# EAGLE design Drinks_MotorDriver-v0.2 (EAGLE 6.4)
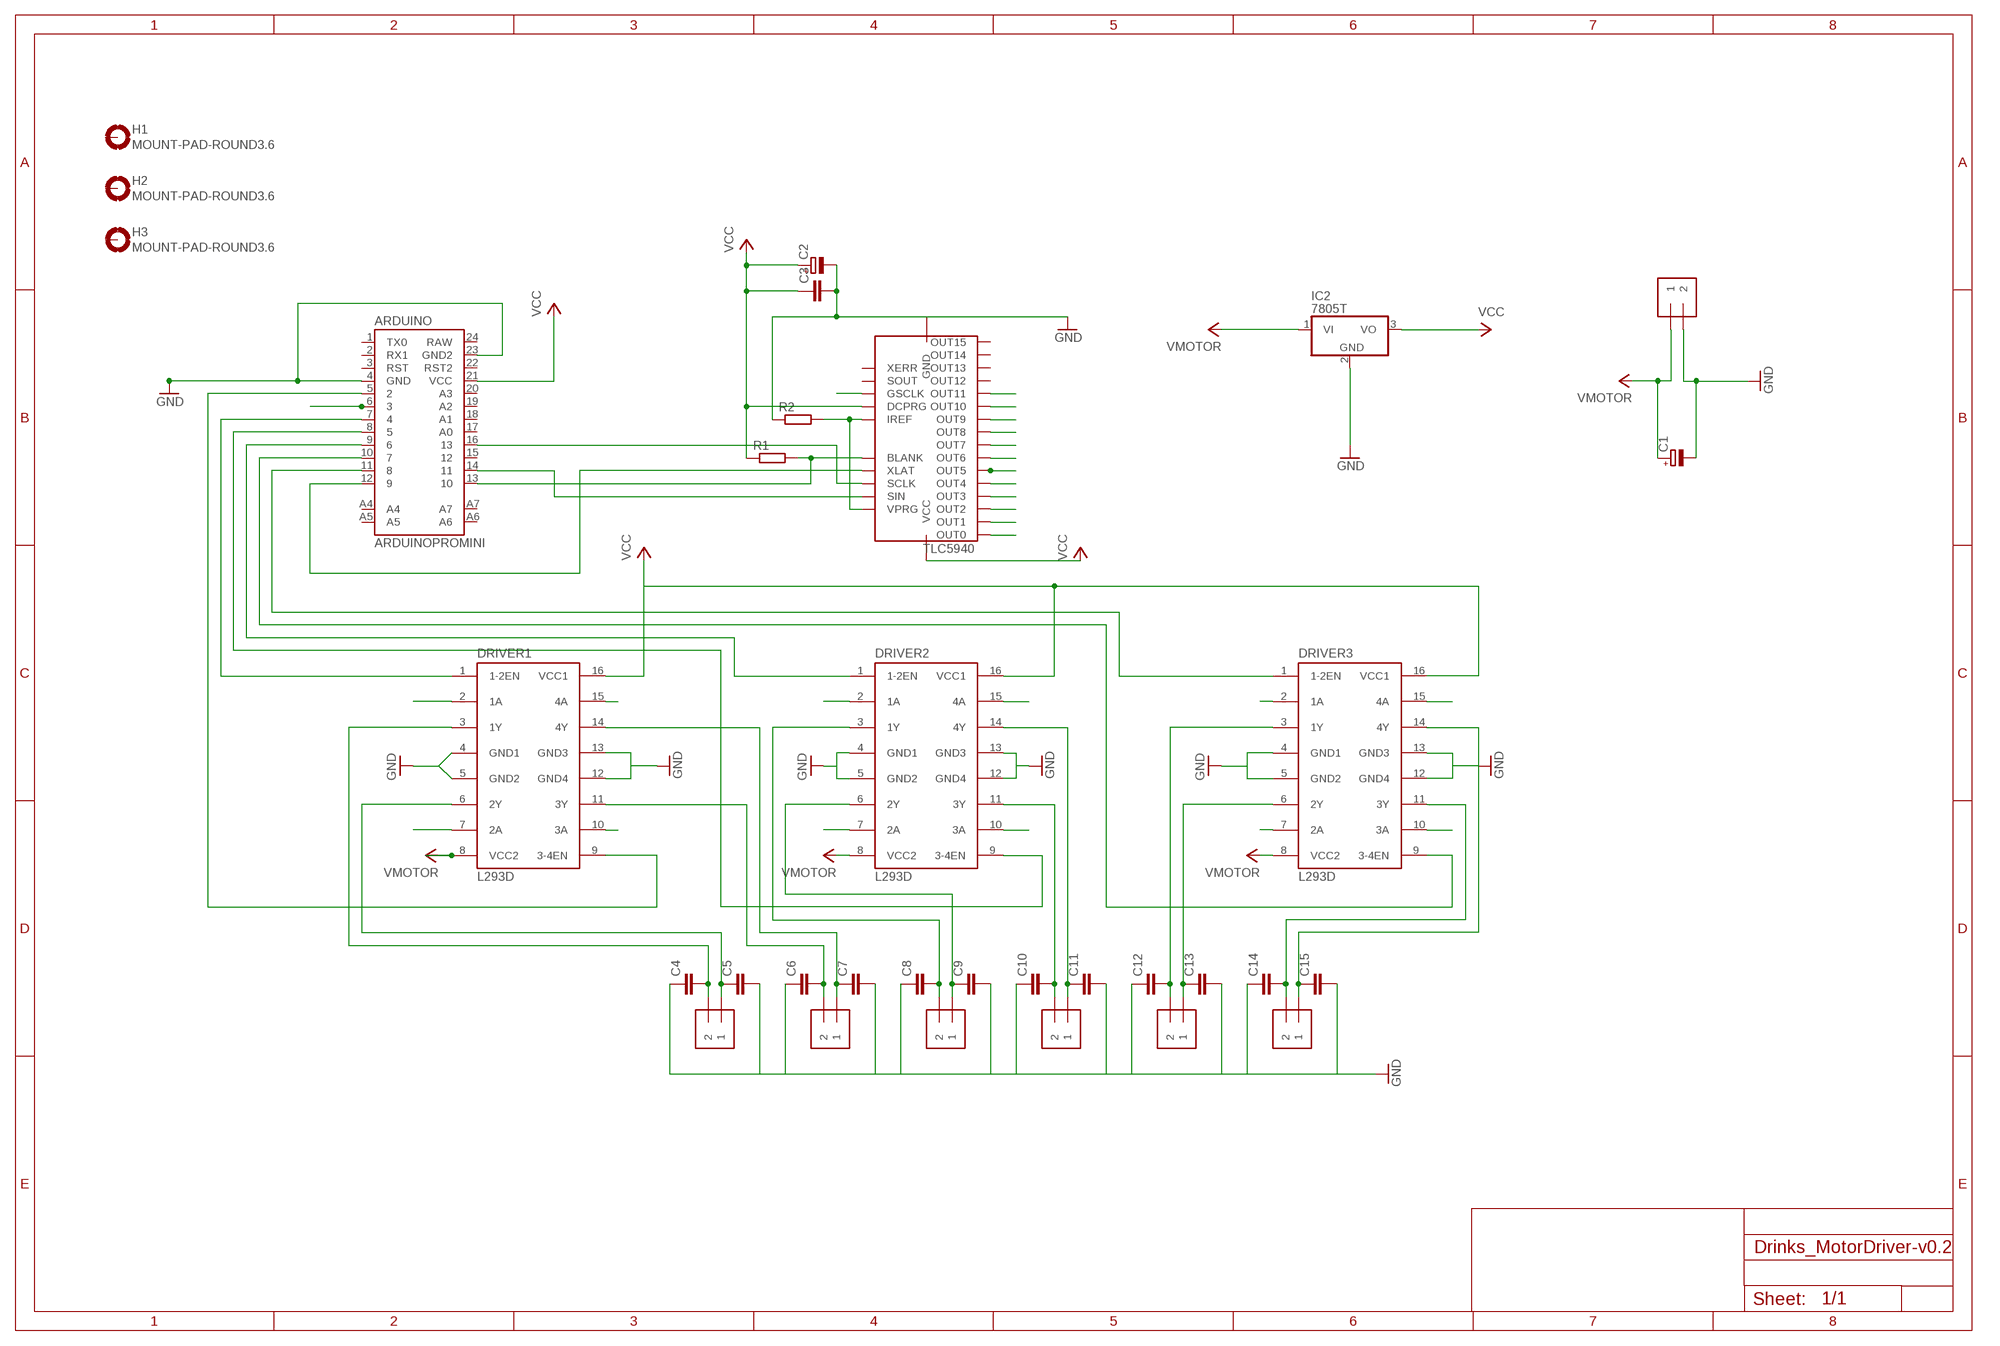
[diagram p0: schematic, sheet 1]

## Parts
ARDUINO  ARDUINOPROMINI  ARDUINO_PRO_MINI  [ARDUINO_PRO_MINI]
C1  CPOL-EUE5-8.5  [E5-8,5]
C2  CPOL-EUE5-8.5  [E5-8,5]
C3  C-EU025-025X050  [C025-025X050]
C4  C-EU025-025X050  [C025-025X050]
C5  C-EU025-025X050  [C025-025X050]
C6  C-EU025-025X050  [C025-025X050]
C7  C-EU025-025X050  [C025-025X050]
C8  C-EU025-025X050  [C025-025X050]
C9  C-EU025-025X050  [C025-025X050]
C10  C-EU025-025X050  [C025-025X050]
C11  C-EU025-025X050  [C025-025X050]
C12  C-EU025-025X050  [C025-025X050]
C13  C-EU025-025X050  [C025-025X050]
C14  C-EU025-025X050  [C025-025X050]
C15  C-EU025-025X050  [C025-025X050]
DRIVER1  L293D  [DIL16]
DRIVER2  L293D  [DIL16]
DRIVER3  L293D  [DIL16]
H1  MOUNT-PAD-ROUND3.6  [3,6-PAD]
H2  MOUNT-PAD-ROUND3.6  [3,6-PAD]
H3  MOUNT-PAD-ROUND3.6  [3,6-PAD]
IC2  7805T  [TO220H]
MOT1  1X2-3.5MM  [1X2-3.5MM]
MOT2  1X2-3.5MM  [1X2-3.5MM]
MOT3  1X2-3.5MM  [1X2-3.5MM]
MOT4  1X2-3.5MM  [1X2-3.5MM]
MOT5  1X2-3.5MM  [1X2-3.5MM]
MOT6  1X2-3.5MM  [1X2-3.5MM]
R1  R-EU_0204/7  [0204/7]
R2  R-EU_0204/7  [0204/7]
TLC5940  IC-PACKAGE_DIL28-4  [IC-PACKAGE_DIL28-4]
VIN  1X2-3.5MM  [1X2-3.5MM]

## Nets
GND: ARDUINO.4(GND) ARDUINO.23(GND2) C1.- C2.- C3.2 C4.1 C5.2 C6.1 C7.2 C8.1 C9.2 C10.1 C11.2 C12.1 C13.2 C14.1 C15.2 DRIVER1.4(GND1) DRIVER1.5(GND2) DRIVER1.12(GND4) DRIVER1.13(GND3) DRIVER2.4(GND1) DRIVER2.5(GND2) DRIVER2.12(GND4) DRIVER2.13(GND3) DRIVER3.4(GND1) DRIVER3.5(GND2) DRIVER3.12(GND4) DRIVER3.13(GND3) IC2.2(GND) R2.1 TLC5940.22(GND) VIN.2
GSCLK: ARDUINO.6 TLC5940.18(GSCLK)
MOT1A: DRIVER1.2(1A) TLC5940.28(OUT0)
MOT1B: DRIVER1.7(2A) TLC5940.1(OUT1)
MOT2A: DRIVER1.10(3A) TLC5940.2(OUT2)
MOT2B: DRIVER1.15(4A) TLC5940.3(OUT3)
MOT3A: DRIVER2.2(1A) TLC5940.4(OUT4)
MOT3B: DRIVER2.7(2A) TLC5940.5(OUT5)
MOT4A: DRIVER2.10(3A) TLC5940.6(OUT6)
MOT4B: DRIVER2.15(4A) TLC5940.7(OUT7)
MOT5A: DRIVER3.2(1A) TLC5940.8(OUT8)
MOT5B: DRIVER3.7(2A) TLC5940.9(OUT9)
MOT6A: DRIVER3.10(3A) TLC5940.10(OUT10)
MOT6B: DRIVER3.15(4A) TLC5940.11(OUT11)
N$1: ARDUINO.13 R1.2 TLC5940.23(BLANK)
N$2: R2.2 TLC5940.20(IREF) TLC5940.27(VPRG)
N$4: ARDUINO.14 TLC5940.26(SIN)
N$6: ARDUINO.12 TLC5940.24(XLAT)
N$12: ARDUINO.5 DRIVER1.9(3-4EN)
N$13: ARDUINO.7 DRIVER1.1(1-2EN)
N$14: ARDUINO.8 DRIVER2.9(3-4EN)
N$16: ARDUINO.9 DRIVER2.1(1-2EN)
N$17: ARDUINO.10 DRIVER3.9(3-4EN)
N$18: ARDUINO.11 DRIVER3.1(1-2EN)
N$19: C4.2 DRIVER1.3(1Y) MOT1.2
N$20: C5.1 DRIVER1.6(2Y) MOT1.1
N$21: C7.1 DRIVER1.14(4Y) MOT2.1
N$22: C6.2 DRIVER1.11(3Y) MOT2.2
N$23: C8.2 DRIVER2.3(1Y) MOT3.2
N$24: C9.1 DRIVER2.6(2Y) MOT3.1
N$25: C10.2 DRIVER2.11(3Y) MOT4.2
N$26: C11.1 DRIVER2.14(4Y) MOT4.1
N$27: C12.2 DRIVER3.3(1Y) MOT5.2
N$28: C13.1 DRIVER3.6(2Y) MOT5.1
N$29: C14.2 DRIVER3.11(3Y) MOT6.2
N$30: C15.1 DRIVER3.14(4Y) MOT6.1
SCLK: ARDUINO.16 TLC5940.25(SCLK)
VCC: ARDUINO.21(VCC) C2.+ C3.1 DRIVER1.16(VCC1) DRIVER2.16(VCC1) DRIVER3.16(VCC1) IC2.3(VO) R1.1 TLC5940.19(DCPRG) TLC5940.21(VCC)
VMOTOR: C1.+ DRIVER1.8(VCC2) DRIVER2.8(VCC2) DRIVER3.8(VCC2) IC2.1(VI) VIN.1
Unconnected: ARDUINO.1(TX0) ARDUINO.2(RX1) ARDUINO.3(RST) ARDUINO.15 ARDUINO.17(A0) ARDUINO.18(A1) ARDUINO.19(A2) ARDUINO.20(A3) ARDUINO.22(RST2) ARDUINO.24(RAW) ARDUINO.A4 ARDUINO.A5 ARDUINO.A6 ARDUINO.A7 H1.B3,6(MOUNT) H2.B3,6(MOUNT) H3.B3,6(MOUNT) TLC5940.12(OUT12) TLC5940.13(OUT13) TLC5940.14(OUT14) TLC5940.15(OUT15) TLC5940.16(XERR) TLC5940.17(SOUT)

## Library data of the parts
ARDUINO = SparkFun-Boards:ARDUINO_PRO_MINI
C1 C2 = rcl:CPOL-EU: POLARIZED CAPACITOR, European symbol
C3-C15 = rcl:C-EU: CAPACITOR, European symbol
DRIVER1-DRIVER3 = st-microelectronics:L293D: PUSH-PULL 4 CHANNEL DRIVER; MPN: L293D; OC_FARNELL: 9589619; OC_NEWARK: 56P8249
H1-H3 = holes:MOUNT-PAD-ROUND: MOUNTING PAD, round
IC2 = adafruit:78*: Positive VOLTAGE REGULATOR Added bigger pads to the TO-92 package
MOT1-MOT6 VIN = adafruit:1X2: 3.5mm Terminal block http://www.ladyada.net/library/pcb/eaglelibrary.html
R1 R2 = resistor:R-EU_: RESISTOR, European symbol
TLC5940 = TLC5940:IC-PACKAGE_DIL28: Dual In Line

## Board
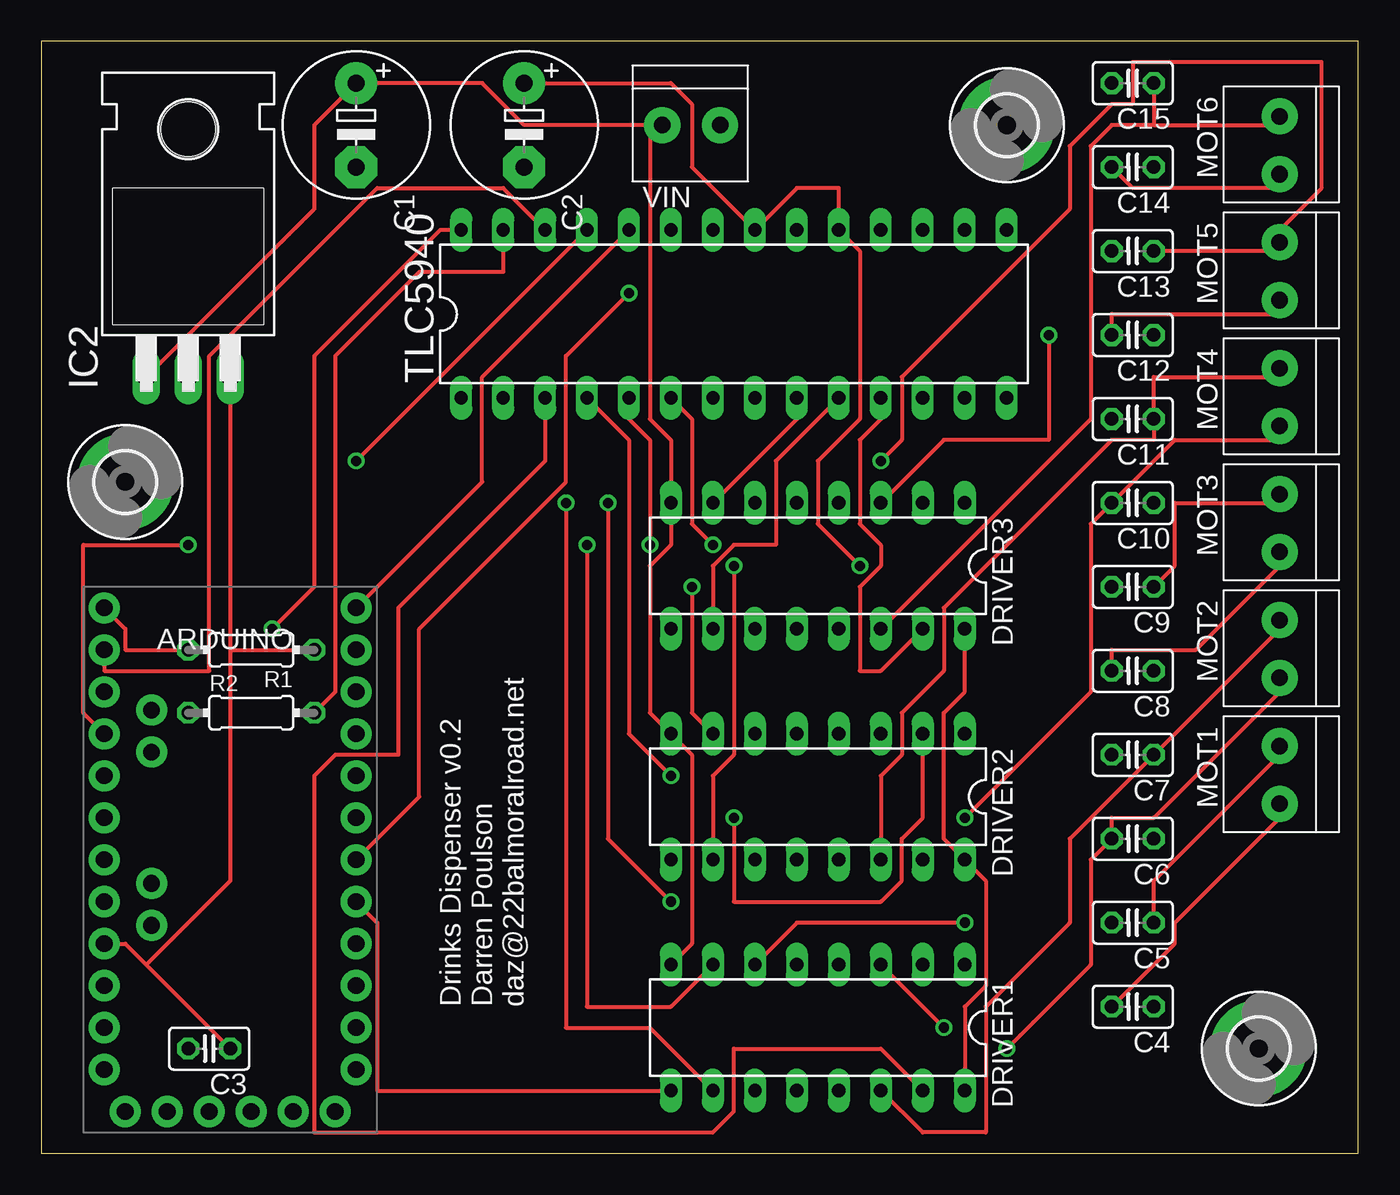
[diagram p1: board, top side]
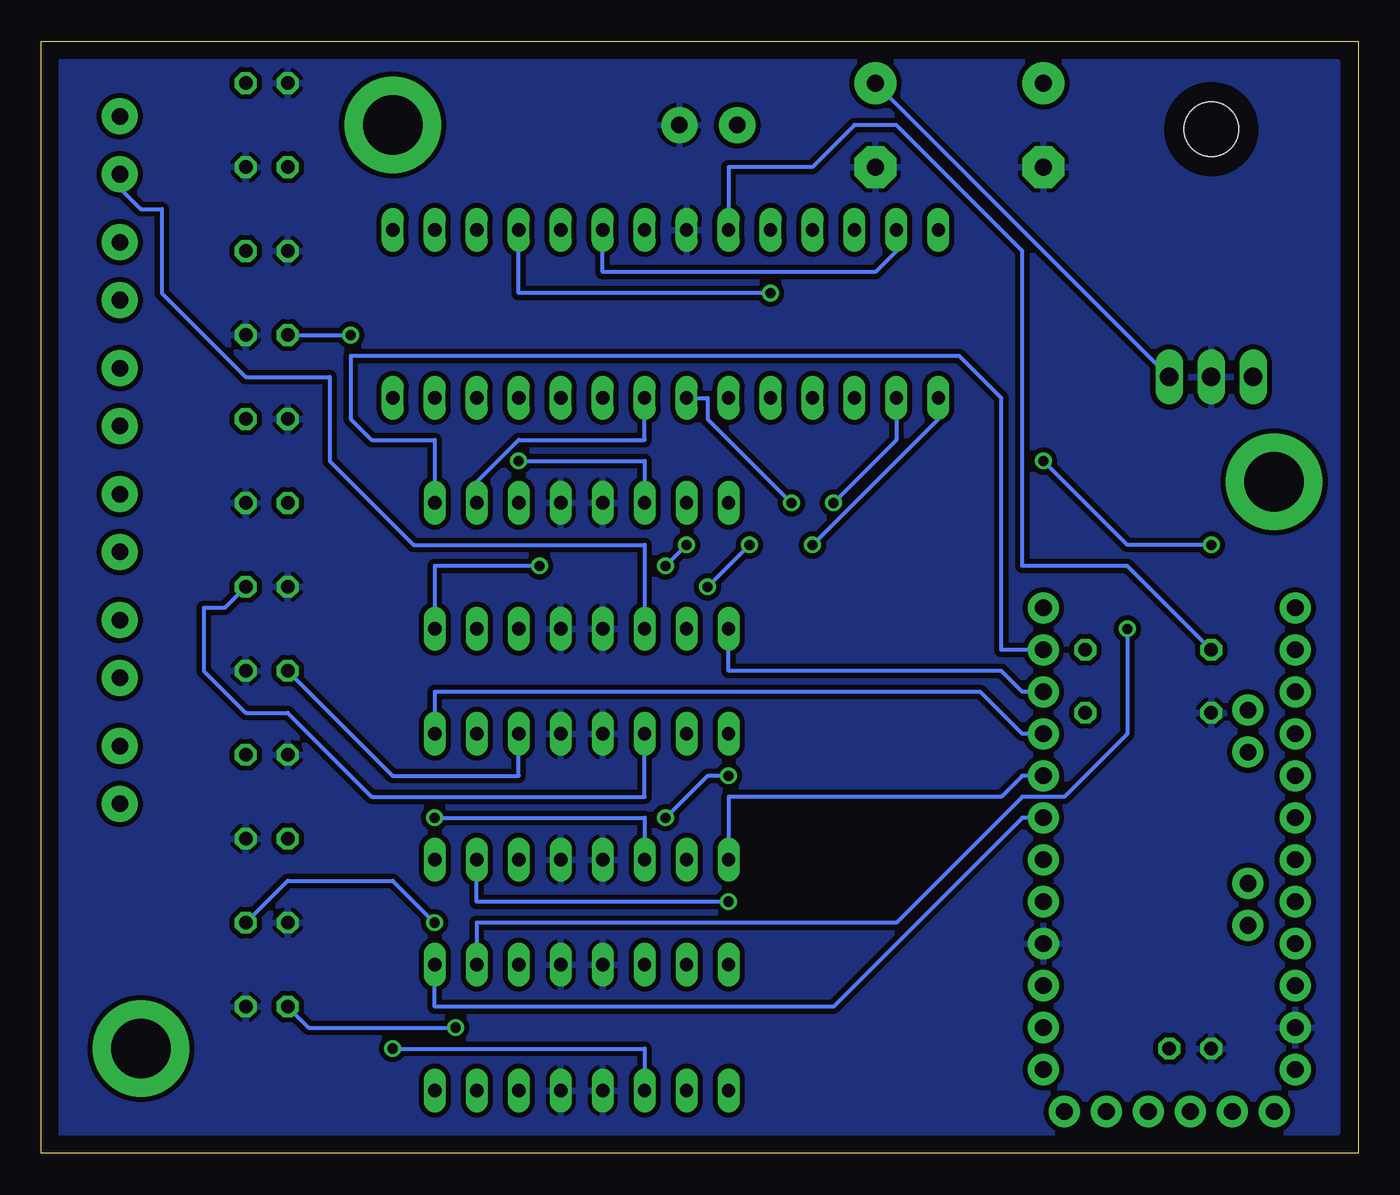
[diagram p2: board, bottom side, seen from below]

Size 79.68 x 67.3 mm. Coordinates in mm from the lower left corner, seen from the top.
Outline: 0,0 79.68,0 79.68,67.3 0,67.3 0,0
Copper layers (1*16): Top 0.035mm / dielectric 1.5mm / Bottom 0.035mm
Design rules "default": minimum track width 10mil, minimum drill 24mil, track to track 8mil, track to pad 8mil, pad to pad 8mil, via to via 8mil, smd to smd 8mil, copper to edge 40mil, drill to drill 8mil, minimum pad ring 10mil, minimum via ring 8mil, stop-mask expansion 4mil, vias tented up to drill 0mil, thermal gap 10mil

### Footprints (pad centres in the part's own frame; a part is rotated, then mirrored left to right if it is on the bottom)
ARDUINO_PRO_MINI = drill 1.016 pad 1.88: 1 -7.62,12.7; 2 -7.62,10.16; 3 -7.62,7.62; 4 -7.62,5.08; 5 -7.62,2.54; 6 -7.62,0; 7 -7.62,-2.54; 8 -7.62,-5.08; 9 -7.62,-7.62; 10 -7.62,-10.16; 11 -7.62,-12.7; 12 -7.62,-15.24; 13 7.62,-15.24; 14 7.62,-12.7; 15 7.62,-10.16; 16 7.62,-7.62; 17 7.62,-5.08; 18 7.62,-2.54; 19 7.62,0; 20 7.62,2.54; 21 7.62,5.08; 22 7.62,7.62; 23 7.62,10.16; 24 7.62,12.7; A4 4.763,1.429; A5 4.763,3.969; A6 4.763,-9.049; A7 4.763,-6.509; BLK -6.35,15.24; GND -3.81,15.24; GRN 6.35,15.24; RXI 1.27,15.24; TXO 3.81,15.24; VCC -1.27,15.24
E5-8,5 = drill 1.016 pad 2.54: + -2.54,0 | drill 1.016 pad 2.54 octagon: - 2.54,0
C025-025X050 = drill 0.813 octagon: 1 -1.27,0; 2 1.27,0
DIL16 = drill 0.813 long: 1 -8.89,-3.81; 2 -6.35,-3.81; 3 -3.81,-3.81; 4 -1.27,-3.81; 5 1.27,-3.81; 6 3.81,-3.81; 7 6.35,-3.81; 8 8.89,-3.81; 9 8.89,3.81; 10 6.35,3.81; 11 3.81,3.81; 12 1.27,3.81; 13 -1.27,3.81; 14 -3.81,3.81; 15 -6.35,3.81; 16 -8.89,3.81
3,6-PAD = drill 3.6 pad 5.842: B3,6 0,0
TO220H = drill 1.118 long: 1 -2.54,-10.16; 2 0,-10.16; 3 2.54,-10.16 | hole 3.302: 0,4.826
1X2-3.5MM = drill 1 pad 2.184: 1 1.8,0; 2 -1.7,0
0204/7 = drill 0.813 octagon: 1 -3.81,0; 2 3.81,0
IC-PACKAGE_DIL28-4 = drill 0.813 long: 1 -16.51,-5.08; 2 -13.97,-5.08; 3 -11.43,-5.08; 4 -8.89,-5.08; 5 -6.35,-5.08; 6 -3.81,-5.08; 7 -1.27,-5.08; 8 1.27,-5.08; 9 3.81,-5.08; 10 6.35,-5.08; 11 8.89,-5.08; 12 11.43,-5.08; 13 13.97,-5.08; 14 16.51,-5.08; 15 16.51,5.08; 16 13.97,5.08; 17 11.43,5.08; 18 8.89,5.08; 19 6.35,5.08; 20 3.81,5.08; 21 1.27,5.08; 22 -1.27,5.08; 23 -3.81,5.08; 24 -6.35,5.08; 25 -8.89,5.08; 26 -11.43,5.08; 27 -13.97,5.08; 28 -16.51,5.08

### Placement (x,y rotation side)
ARDUINO  11.43,17.78 180 top
C1  19.05,62.23 270 top
C2  29.21,62.23 270 top
C3  10.16,6.35 180 top
C4  66.04,8.89 180 top
C5  66.04,13.97 180 top
C6  66.04,19.05 180 top
C7  66.04,24.13 180 top
C8  66.04,29.21 180 top
C9  66.04,34.29 180 top
C10  66.04,39.37 180 top
C11  66.04,44.45 180 top
C12  66.04,49.53 180 top
C13  66.04,54.61 180 top
C14  66.04,59.69 180 top
C15  66.04,64.77 180 top
DRIVER1  46.99,7.62 180 top
DRIVER2  46.99,21.59 180 top
DRIVER3  46.99,35.56 180 top
H1  73.66,6.35 0 top
H2  58.42,62.23 0 top
H3  5.08,40.64 0 top
IC2  8.89,57.15 0 top
MOT1  74.93,22.86 90 top
MOT2  74.93,30.48 90 top
MOT3  74.93,38.1 90 top
MOT4  74.93,45.72 90 top
MOT5  74.93,53.34 90 top
MOT6  74.93,60.96 90 top
R1  12.7,30.48 180 top
R2  12.7,26.67 0 top
TLC5940  41.91,50.8 0 top
VIN  39.37,62.23 180 top

### Tracks (layer width: path | path; a pad name or v marks a point on that pad's centre or on a via)
GND
  pour Bottom (isolate 0.305): 1.27,66.04 78.74,66.04 78.74,1.27 1.27,1.27
GSCLK  (via drill 0.61)
  Top 0.254: v35.56,52.07 31.75,48.26 31.75,40.64 22.86,31.75 22.86,21.59 ARDUINO.6
  Bottom 0.254: TLC5940.18 50.8,52.07 v35.56,52.07
MOT1A  (via drill 0.61)
  Top 0.254: v13.97,31.75 16.51,34.29 16.51,48.26 24.13,55.88 TLC5940.28
  Bottom 0.254: DRIVER1.2 53.34,13.97 27.94,13.97 20.32,21.59 17.78,21.59 13.97,25.4 v13.97,31.75
MOT1B  (via drill 0.61)
  Top 0.254: DRIVER1.7 38.1,8.89 33.02,8.89 v33.02,36.83
  Bottom 0.254: v33.02,36.83 25.4,44.45 TLC5940.1
MOT2A  (via drill 0.61)
  Top 0.254: DRIVER1.10 36.83,7.62 31.75,7.62 v31.75,39.37
  Bottom 0.254: v31.75,39.37 27.94,43.18 TLC5940.2
MOT2B
  Top 0.254: DRIVER1.15 50.8,6.35 41.91,6.35 41.91,2.54 40.64,1.27 16.51,1.27 16.51,22.86 17.78,24.13 21.59,24.13 21.59,33.02 30.48,41.91 TLC5940.3
MOT3A  (via drill 0.61)
  Top 0.254: DRIVER2.2 53.34,20.32 52.07,19.05 52.07,16.51 50.8,15.24 41.91,15.24 v41.91,20.32 | v38.1,22.86 35.56,25.4 35.56,43.18 TLC5940.4
  Bottom 0.254: v41.91,20.32 39.37,22.86 v38.1,22.86
MOT3B  (via drill 0.61)
  Top 0.254: DRIVER2.7 39.37,26.67 v39.37,34.29 | v36.83,36.83 36.83,43.18 35.56,44.45 TLC5940.5
  Bottom 0.254: v36.83,36.83 v39.37,34.29
MOT4A  (via drill 0.61)
  Top 0.254: DRIVER2.10 40.64,22.86 41.91,24.13 v41.91,35.56 | v40.64,36.83 39.37,38.1 39.37,44.45 TLC5940.6
  Bottom 0.254: v40.64,36.83 v41.91,35.56
MOT4B  (via drill 0.61)
  Top 0.254: v38.1,15.24 34.29,19.05 v34.29,39.37
  Bottom 0.254: DRIVER2.15 53.34,15.24 v38.1,15.24 | v34.29,39.37 39.37,44.45 39.37,45.72 TLC5940.7
MOT5A
  Bottom 0.254: TLC5940.8 43.18,43.18 50.8,43.18 53.34,40.64 DRIVER3.2
MOT5B
  Top 0.254: DRIVER3.7 45.72,44.45 TLC5940.9
MOT6A
  Top 0.254: DRIVER3.10 40.64,35.56 41.91,36.83 44.45,36.83 44.45,41.91 TLC5940.10
MOT6B
  Top 0.254: DRIVER3.15 50.8,29.21 49.53,29.21 49.53,34.29 50.8,35.56 50.8,36.83 49.53,38.1 49.53,43.18 50.8,44.45 TLC5940.11
N$1
  Top 0.254: R1.2 5.08,30.48 5.08,31.75 ARDUINO.13
  Bottom 0.254: TLC5940.23 38.1,59.69 33.02,59.69 30.48,62.23 27.94,62.23 20.32,54.61 20.32,35.56 13.97,35.56 R1.2
N$2
  Top 0.254: R2.2 17.78,27.94 17.78,48.26 22.86,53.34 27.94,53.34 TLC5940.27
  Bottom 0.254: TLC5940.20 45.72,53.34 29.21,53.34 27.94,54.61 TLC5940.27
N$4
  Top 0.254: TLC5940.26 27.94,58.42 20.32,58.42 10.16,48.26 10.16,29.21 3.81,29.21 ARDUINO.14
N$6
  Top 0.254: TLC5940.24 26.67,46.99 26.67,40.64 ARDUINO.12
N$12
  Top 0.254: DRIVER1.9 20.32,3.81 20.32,13.97 ARDUINO.5
N$13
  Bottom 0.254: DRIVER1.1 55.88,8.89 31.75,8.89 20.32,20.32 ARDUINO.7
N$14
  Bottom 0.254: DRIVER2.9 38.1,21.59 21.59,21.59 20.32,22.86 ARDUINO.8
N$16
  Bottom 0.254: DRIVER2.1 55.88,27.94 22.86,27.94 20.32,25.4 ARDUINO.9
N$17
  Bottom 0.254: DRIVER3.9 38.1,29.21 21.59,29.21 20.32,27.94 ARDUINO.10
N$18
  Bottom 0.254: DRIVER3.1 55.88,43.18 59.69,43.18 60.96,44.45 60.96,48.26 24.13,48.26 21.59,45.72 21.59,30.48 ARDUINO.11
N$19  (via drill 0.61)
  Top 0.254: v54.61,7.62 DRIVER1.3 | C4.2 68.58,12.7 68.58,13.97 74.93,20.32 MOT1.2
  Bottom 0.254: v54.61,7.62 63.5,7.62 C4.2
N$20  (via drill 0.61)
  Top 0.254: DRIVER1.6 45.72,13.97 v55.88,13.97 | C5.1 67.31,16.51 74.93,24.13 MOT1.1
  Bottom 0.254: v55.88,13.97 58.42,16.51 64.77,16.51 C5.1
N$21
  Top 0.254: DRIVER1.14 53.34,1.27 57.15,1.27 57.15,8.89 62.23,13.97 62.23,19.05 C7.1 74.93,31.75 MOT2.1
N$22  (via drill 0.61)
  Top 0.254: v58.42,6.35 63.5,11.43 63.5,17.78 C6.2 64.77,20.32 67.31,20.32 74.93,27.94 MOT2.2
  Bottom 0.254: DRIVER1.11 43.18,6.35 v58.42,6.35
N$23
  Top 0.254: C8.2 64.77,30.48 69.85,30.48 74.93,35.56 MOT3.2
  Bottom 0.254: DRIVER2.3 50.8,22.86 58.42,22.86 C8.2
N$24
  Top 0.254: C9.1 68.58,35.56 68.58,39.37 74.93,39.37 MOT3.1
  Bottom 0.254: DRIVER2.6 43.18,21.59 59.69,21.59 64.77,26.67 67.31,26.67 69.85,29.21 69.85,33.02 68.58,33.02 C9.1
N$25  (via drill 0.61)
  Top 0.254: v55.88,20.32 63.5,27.94 63.5,38.1 C10.2 68.58,43.18 74.93,43.18 MOT4.2
  Bottom 0.254: DRIVER2.11 43.18,20.32 v55.88,20.32
N$26
  Top 0.254: DRIVER2.14 50.8,22.86 52.07,24.13 52.07,26.67 54.61,29.21 54.61,33.02 64.77,43.18 67.31,43.18 C11.1 67.31,46.99 74.93,46.99 MOT4.1
N$27  (via drill 0.61)
  Top 0.254: DRIVER3.3 54.61,43.18 60.96,43.18 v60.96,49.53 | C12.2 64.77,50.8 74.93,50.8 MOT5.2
  Bottom 0.254: C12.2 v60.96,49.53
N$28  (via drill 0.61)
  Top 0.254: v50.8,41.91 52.07,43.18 52.07,46.99 62.23,57.15 62.23,60.96 64.77,63.5 66.04,63.5 66.04,66.04 77.47,66.04 77.47,58.42 74.93,55.88 MOT5.1 74.93,54.61 C13.1
  Bottom 0.254: DRIVER3.6 43.18,41.91 v50.8,41.91
N$29
  Top 0.254: C14.2 66.04,58.42 74.93,58.42 MOT6.2
  Bottom 0.254: DRIVER3.11 43.18,36.83 57.15,36.83 62.23,41.91 62.23,46.99 67.31,46.99 72.39,52.07 72.39,57.15 73.66,57.15 74.93,58.42 MOT6.2
N$30
  Top 0.254: DRIVER3.14 63.5,44.45 63.5,60.96 64.77,62.23 67.31,62.23 | C15.1 67.31,62.23 | 67.31,62.23 74.93,62.23 MOT6.1
SCLK  (via drill 0.61)
  Top 0.254: v19.05,41.91 TLC5940.25 | v8.89,36.83 2.54,36.83 2.54,26.67 ARDUINO.16
  Bottom 0.254: v19.05,41.91 13.97,36.83 v8.89,36.83
VCC  (via drill 0.61)
  Top 0.254: 6.35,11.43 5.08,12.7 ARDUINO.21 | 6.35,11.43 C3.1 | 11.43,30.48 R1.1 | IC2.3 11.43,30.48 | 6.35,11.43 11.43,16.51 11.43,30.48 | DRIVER1.16 55.88,8.89 57.15,10.16 57.15,16.51 DRIVER2.16 54.61,19.05 54.61,26.67 55.88,27.94 DRIVER3.16 | C2.+ 38.1,64.77 39.37,63.5 39.37,59.69 TLC5940.21 45.72,58.42 48.26,58.42 TLC5940.19 49.53,54.61 49.53,44.45 46.99,41.91 46.99,38.1 v49.53,35.56
  Bottom 0.254: DRIVER3.16 55.88,35.56 v49.53,35.56 | C2.+ IC2.3
VMOTOR
  Top 0.254: IC2.1 16.51,57.15 16.51,62.23 C1.+ 26.67,64.77 29.21,62.23 36.83,62.23 | DRIVER1.8 39.37,12.7 39.37,24.13 DRIVER2.8 36.83,26.67 36.83,35.56 38.1,36.83 DRIVER3.8 38.1,43.18 36.83,44.45 36.83,62.23 | 36.83,62.23 VIN.1

### Text on the board
_tsilk: Drinks Dispenser v0.2 / Darren Poulson / daz@22balmoralroad.net